# Altium schematic sheet CT310高端控制盒IJ区按键电路V1.0.SchDoc
size A4
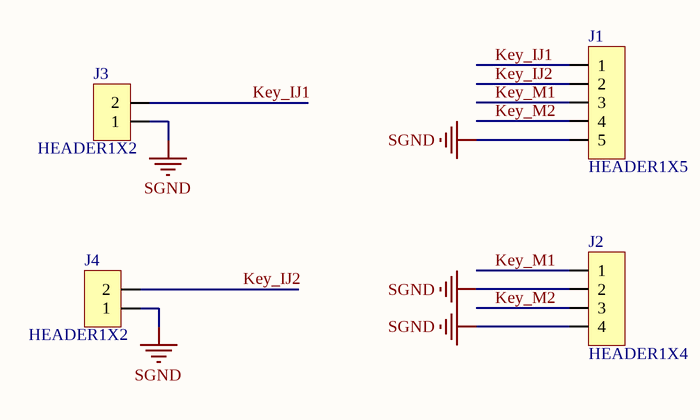
[diagram p0: CT310高端控制盒IJ区按键电路V1.0.SchDoc]

## Parts
J1  HEADER1X5  [ZH1X5LT-1.5]
J2  HEADER1X4  [ZH1X4LT-1.5]
J3  HEADER1X2  [SW-MEC]
J4  HEADER1X2  [SW-MEC]

## Nets
SGND: J1.5 J2.2 J2.4 J3.1 J4.1
Key_IJ1: J1.1 J3.2
Key_IJ2: J1.2 J4.2
Key_M1: J1.3 J2.1
Key_M2: J1.4 J2.3